# Altium schematic sheet IMU.SchDoc
size 420 x 297 mm; SheetNumber: 23; SheetTotal: 32
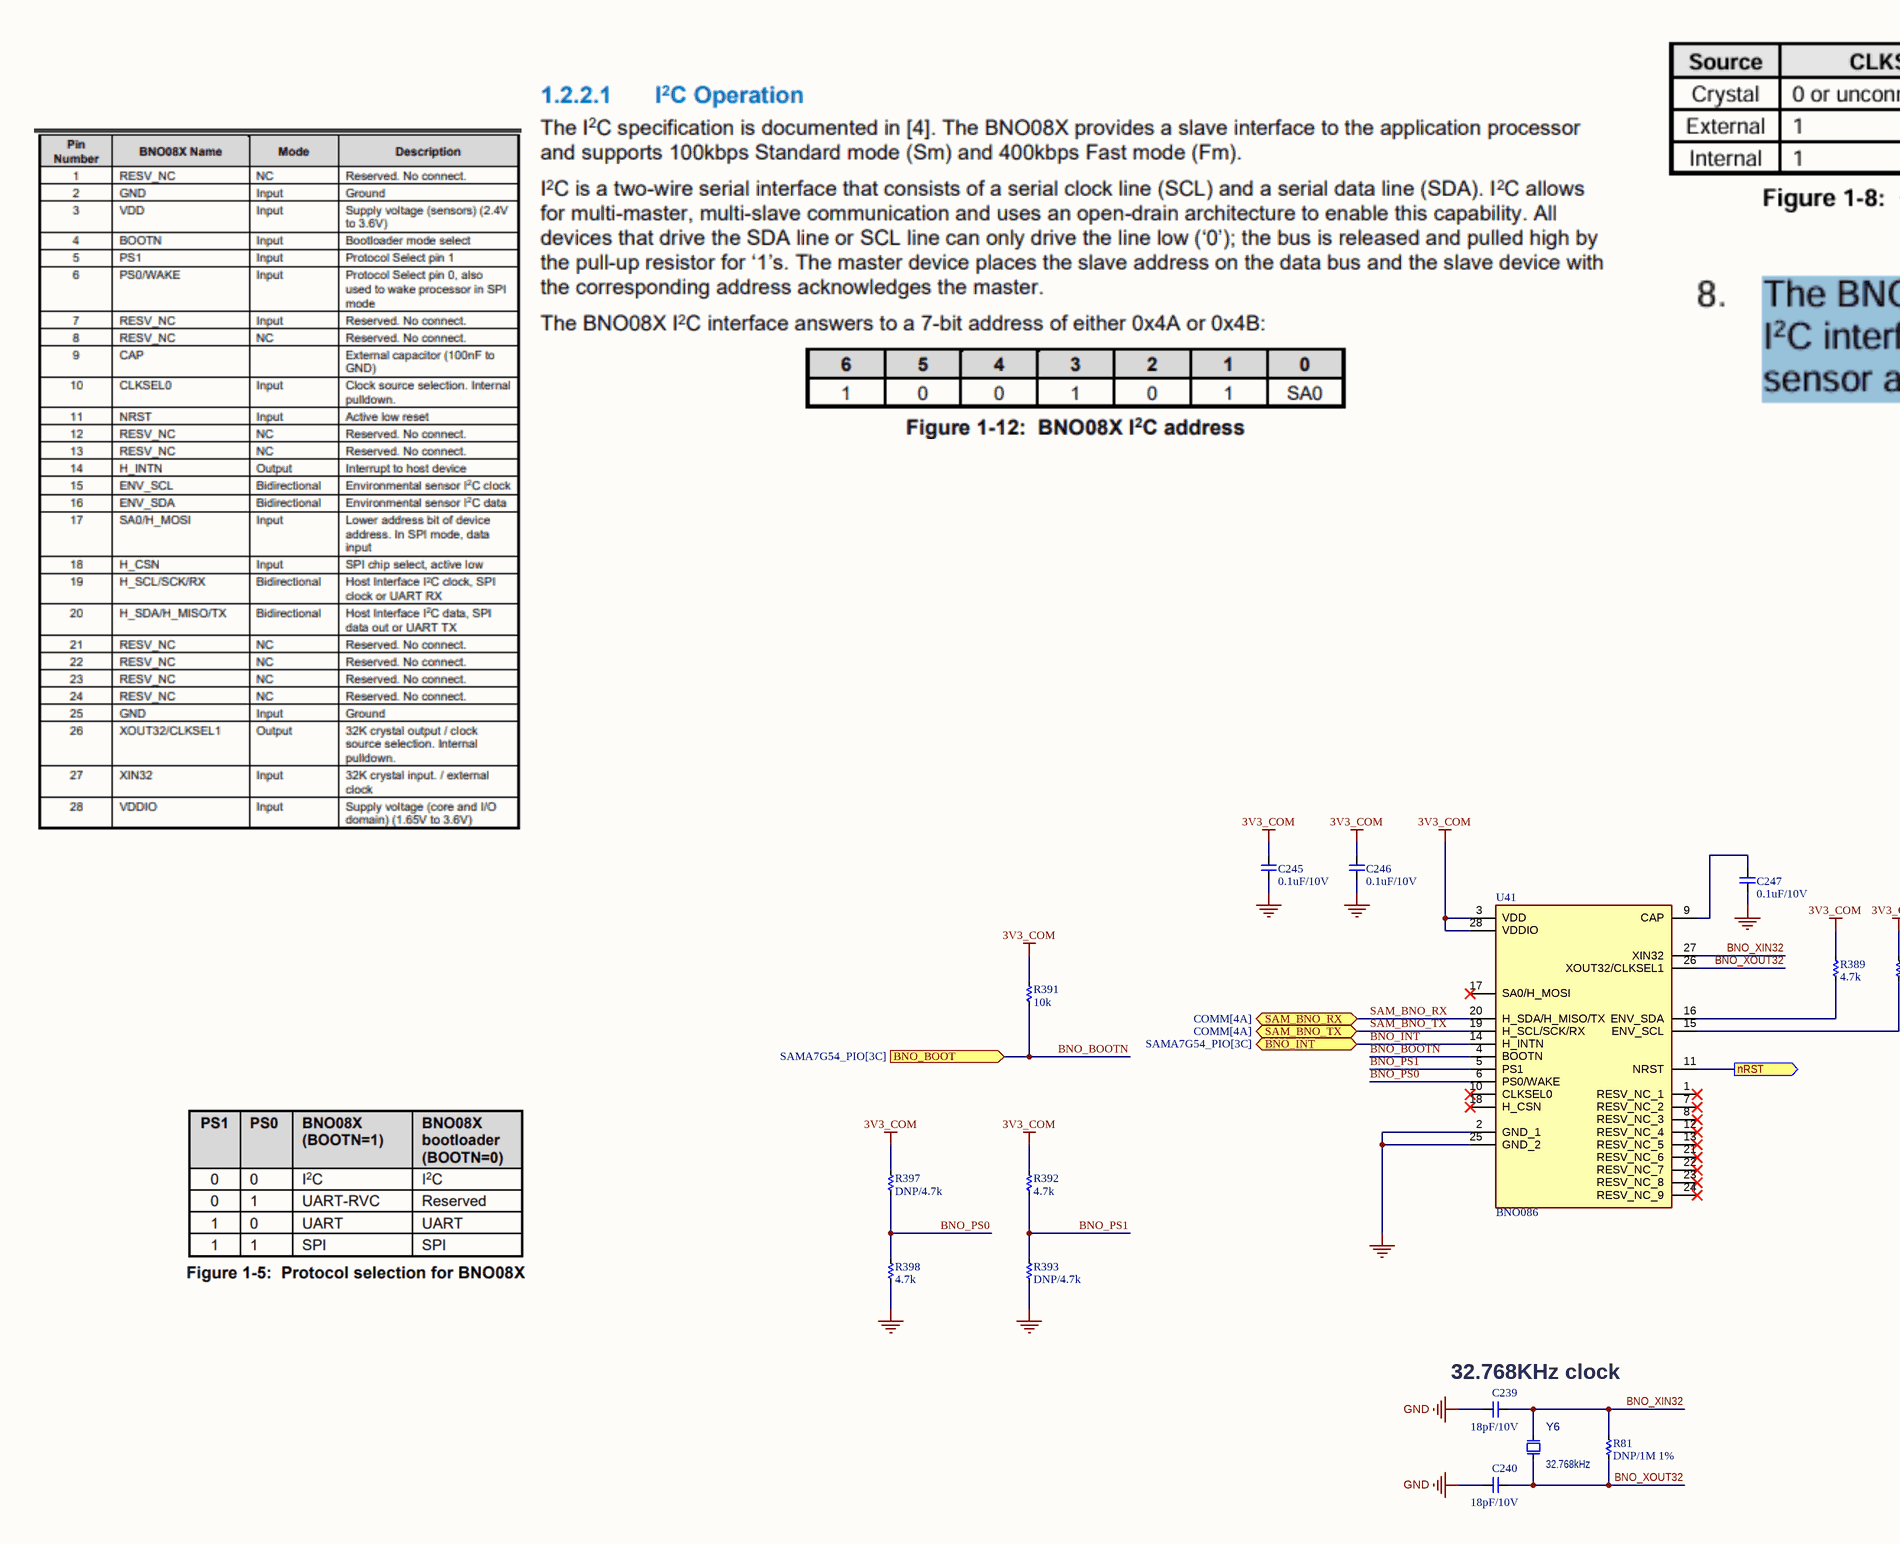
[diagram p0: IMU.SchDoc, left]
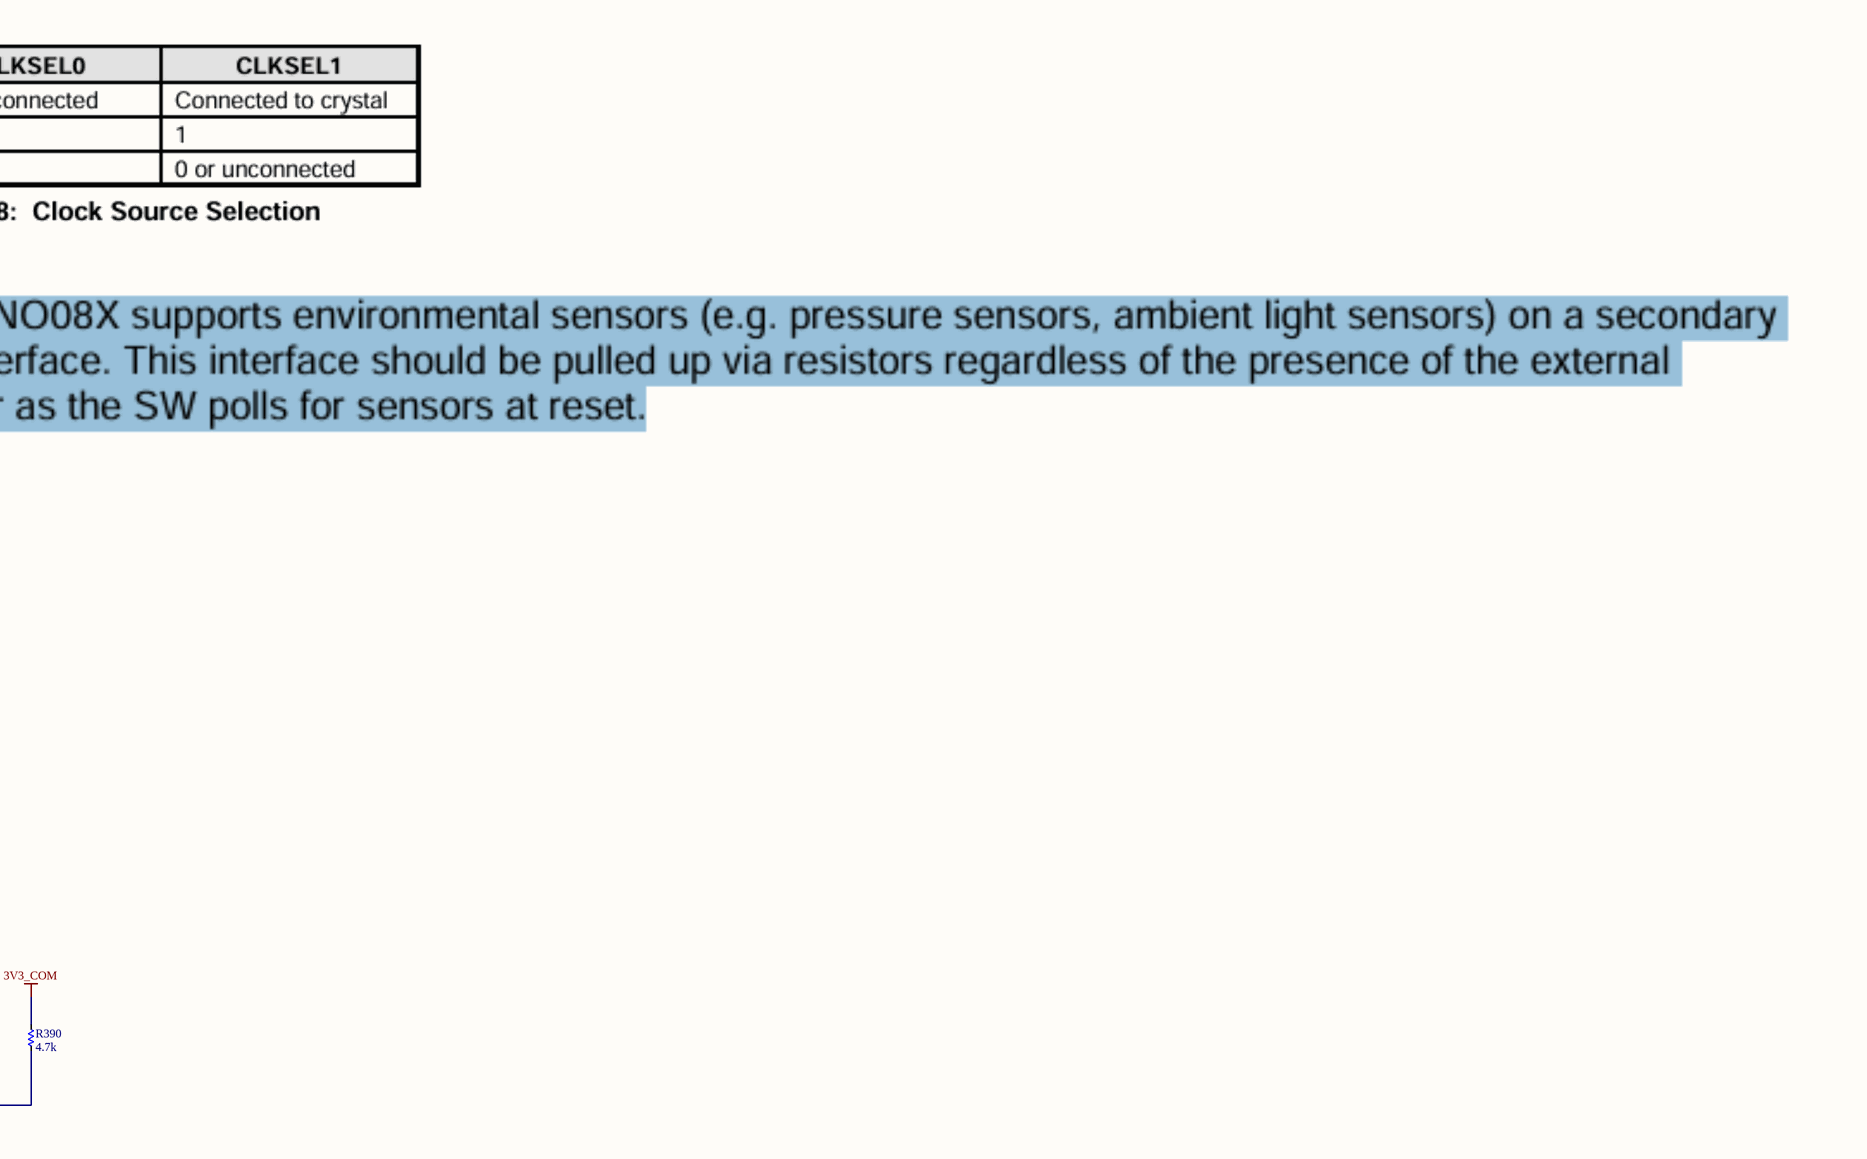
[diagram p1: IMU.SchDoc, right]

## Parts
C239  18pF/10V  [CAP_C_1005X50_L]
C240  18pF/10V  [CAP_C_1005X50_L]
C245  0.1uF/10V  [CAP_C_1005X50_L]
C246  0.1uF/10V  [CAP_C_1005X50_L]
C247  0.1uF/10V  [CAP_C_1005X50_L]
R81  DNP/1M 1%  [RES_C_1005x30_L]
R389  4.7k  [RES_C_1005x30_L]
R390  4.7k  [RES_C_1005x30_L]
R391  10k  [RES_C_1005x30_L]
R392  4.7k  [RES_C_1005x30_L]
R393  DNP/4.7k  [RES_C_1005x30_L]
R397  DNP/4.7k  [RES_C_1005x30_L]
R398  4.7k  [RES_C_1005x30_L]
U41  BNO086  [BNO086]
Y6  value 32.768kHz  [CRYSTAL_NX2012SA]  (hidden comment: Crystal 2 Pins)

## Ports
BNO_BOOT (in, see SAMA7G54_PIO[3C]), BNO_INT (bidir, see SAMA7G54_PIO[3C]), nRST (out, see SAMA7G54_MPU[1A], SAMA7G54_MPU[2D], SAMA7G54_PIO[3D], SAMA7G54_PMIC[3B], WATCHDOG[4B]), SAM_BNO_RX (bidir, see COMM[4A]), SAM_BNO_TX (bidir, see COMM[4A])

## Nets
3V3_COM: C245.2 C246.2 R389.1 R390.1 R391.1 R392.1 R397.1 U41.3(VDD) U41.28(VDDIO)
GND: C239.2 C240.2 C245.1 C246.1 C247.1 R393.2 R398.2 U41.2(GND_1) U41.25(GND_2)
BNO_BOOTN: R391.2 U41.4(BOOTN) ; port BNO_BOOT
BNO_INT: U41.14(H_INTN) ; port BNO_INT
BNO_PS0: R397.2 R398.1 U41.6(PS0/WAKE)
BNO_PS1: R392.2 R393.1 U41.5(PS1)
BNO_XIN32: C239.1 R81.1 U41.27(XIN32) Y6.2(Osc2)
BNO_XOUT32: C240.1 R81.2 U41.26(XOUT32/CLKSEL1) Y6.1(Osc1)
nRST: U41.11(NRST) ; port nRST
SAM_BNO_RX: U41.20(H_SDA/H_MISO/TX) ; port SAM_BNO_RX
SAM_BNO_TX: U41.19(H_SCL/SCK/RX) ; port SAM_BNO_TX
NetC247_2: C247.2 U41.9(CAP)
NetR389_2: R389.2 U41.16(ENV_SDA)
NetR390_2: R390.2 U41.15(ENV_SCL)

Not connected (* = marked no-connect by the designer): U41 1(RESV_NC_1)* 7(RESV_NC_2)* 8(RESV_NC_3)* 10(CLKSEL0)* 12(RESV_NC_4)* 13(RESV_NC_5)* 17(SA0/H_MOSI)* 18(H_CSN)* 21(RESV_NC_6)* 22(RESV_NC_7)* 23(RESV_NC_8)* 24(RESV_NC_9)*

## Notes on the sheet
- (near C239) 32.768KHz clock
- Project:
- Sub-system:
- Design by:
- Sheet title:
- Sheet
- A3
- of
- Checked by:
- Approved by:
- Revision:
- Document No:
- Size:
- Date:

## Library data of the parts
C239 C240 C245-C247 = _CAP_C_2: CAP
R81 R389-R393 R397 R398 = _RES_B_2: RES
U41 = BNO086: Accelerometer, Gyroscope, Magnetometer, Temperature, 9 Axis Sensor IC, SPI Output; Manufacturer_Name: CEVA; Geometry.Height: 1.18mm; Mouser Part Number: 526-BNO086; Mouser Price/Stock: https://www.mouser.co.uk/ProductDetail/CEVA/BNO086?qs=ulEaXIWI0c%2FqTo1scjodAw%3D%3D; Manufacturer_Part_Number: BNO086; Datasheet Link: *
Y6 = OSC_32.768kHz: Crystal; Manufacturer 1: NDK; Manufacturer Part Number 1: NX2012SA-32.768K-STD-MUB-1; MCHP-ID: OSC1092; Description_: CRYSTAL 32.768kHz 12.5pF SMD NX2012SA; Dev Tools Status: Production; Owner: Jamus Griego; Tolerance: ±20ppm; Load Capacitance: 12.5pF; Populated: YES; Revision: 1; Symbol: Crystal 2 Pins; Status: MCL Design; ComponentLink1URL: https://chn-vm-apps.microchip.com/mchprepo/parts/Datasheets/c_NX2012SA-STD-MUB-1_e.pdf; ComponentLink1Description: SVN Datasheet; ComponentLink2URL: C:\ALTIUM_WORK\00001_MCHP-CDB\Datasheets\c_NX2012SA-STD-MUB-1_e.pdf; ComponentLink2Description: Local Datasheet; ComponentLink3URL: C:\ALTIUM_WORK\00001_MCHP-CDB\Library\LibraryRefs\Crystal 2 Pins.SchLib; ComponentLink3Description: Open Symbol; ComponentLink4URL: C:\ALTIUM_WORK\00001_MCHP-CDB\Library\Footprints\CRYSTAL_NX2012SA.PcbLib; ComponentLink4Description: Open Footprint; ComponentLink5Description: Open Footprint 2; ComponentLink6Description: Open Footprint 3; ComponentLink7Description: Open Footprint 4; Type: Crystal; Category: Crystal/Oscillator; Supplier 1: Digi-Key; Supplier Part Number 1: 644-1219-1-ND; Quantity Override: 1